# EAGLE design LaserModulev1.1 (EAGLE 7.5.0)
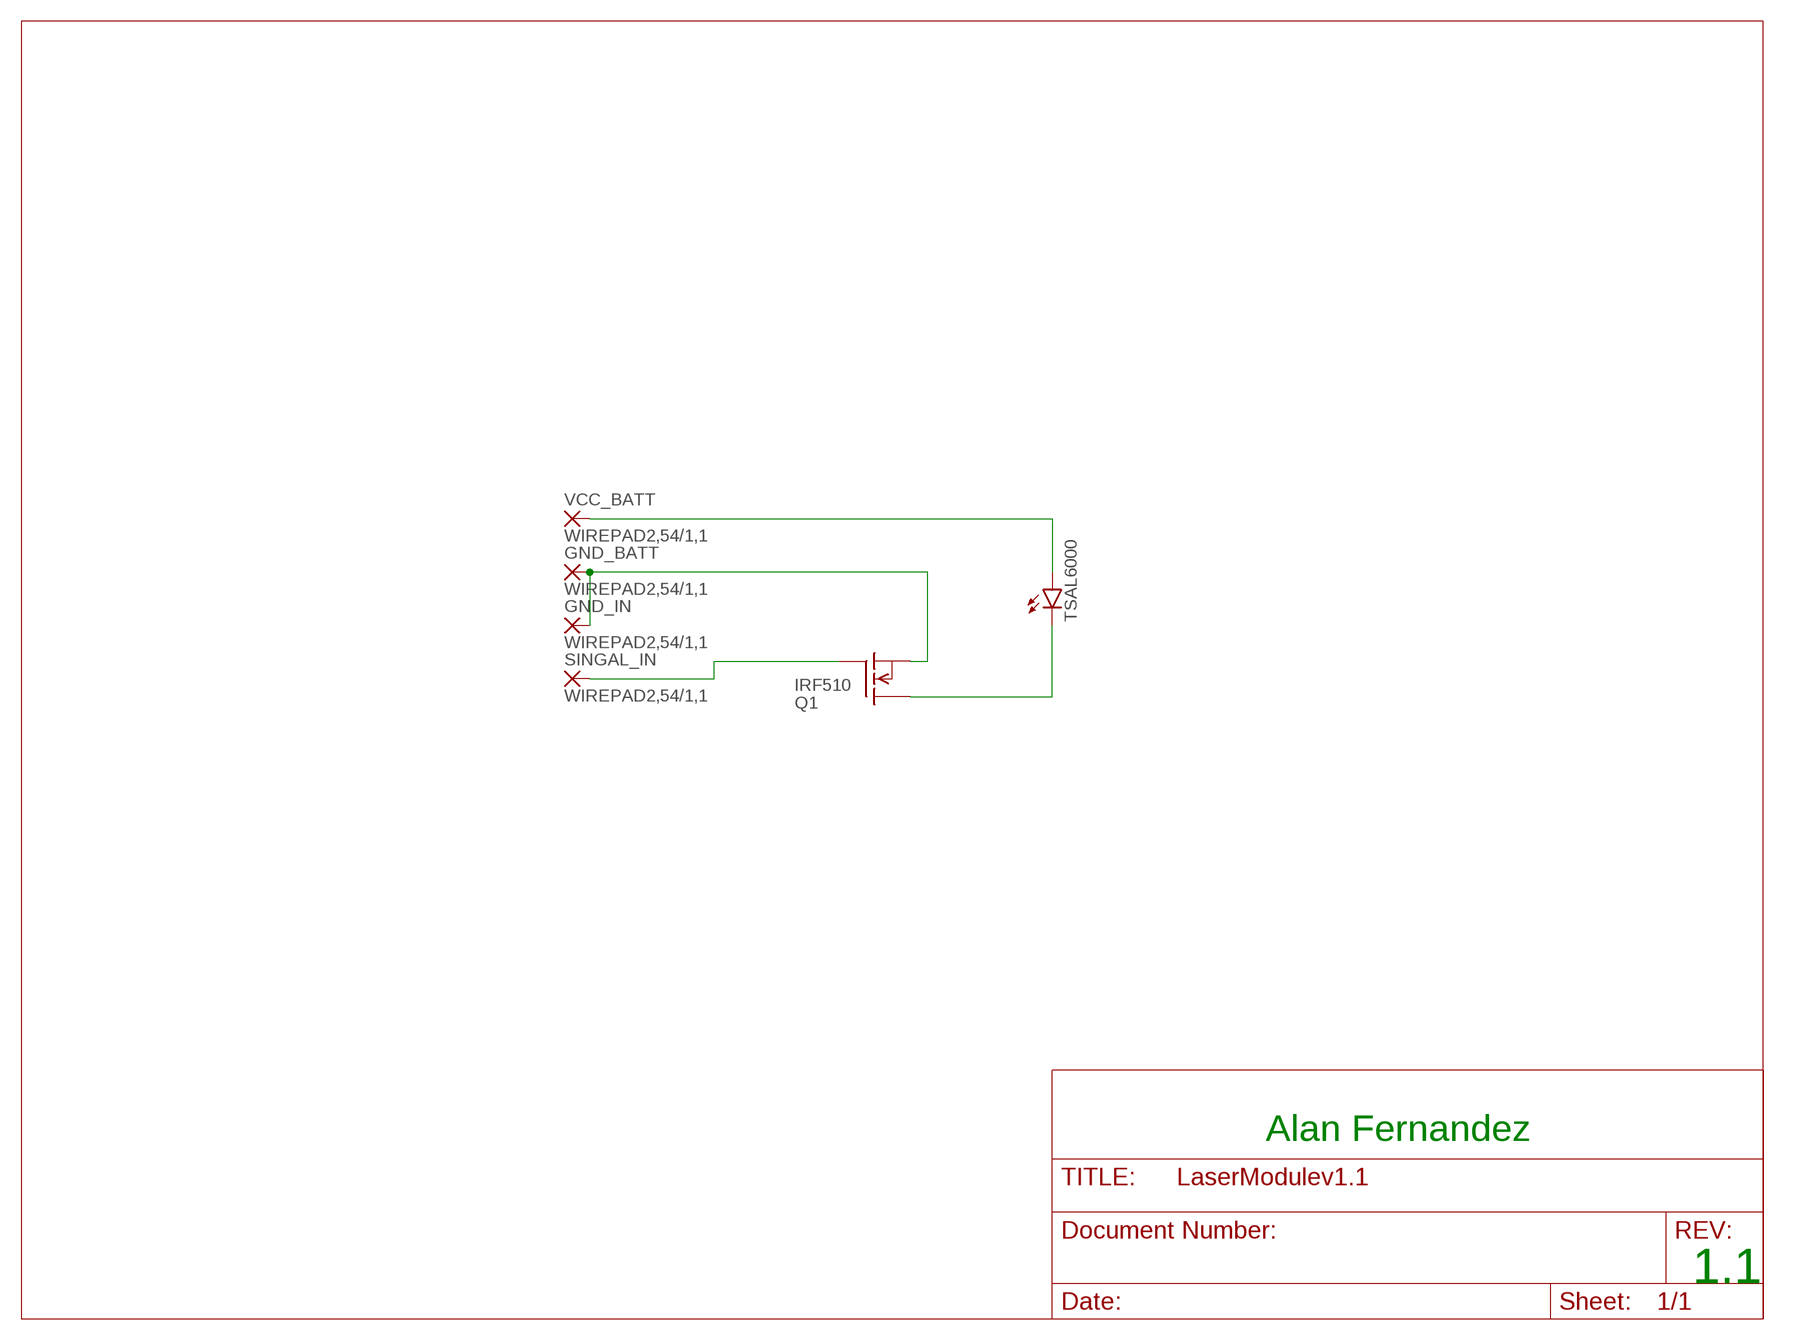
[diagram p0: schematic, sheet 1]

## Parts
GND_BATT  WIREPAD2,54/1,1  [2,54/1,1]
GND_IN  WIREPAD2,54/1,1  [2,54/1,1]
Q1  IRF510  [TO220]
SINGAL_IN  WIREPAD2,54/1,1  [2,54/1,1]
TSAL6000  LED5MM  [LED5MM]
VCC_BATT  WIREPAD2,54/1,1  [2,54/1,1]

## Nets
GND: GND_BATT.1(P) GND_IN.1(P) Q1.3(S)
N$1: Q1.1(G) SINGAL_IN.1(P)
N$3: TSAL6000.A VCC_BATT.1(P)
N$4: Q1.2(D) TSAL6000.K(C)

## Notes on the sheet
- Alan Fernandez
- 1.1

## Library data of the parts
GND_BATT GND_IN SINGAL_IN VCC_BATT = wirepad:WIREPAD: Wire PAD connect wire on PCB
Q1 = transistor-fet:IRF510: N-Channel Enhancement MOSFET (HEXFET); 100V; 5,6A; 0,54Ohm
TSAL6000 = SparkFun-LED:LED: LEDs Standard schematic elements and footprints for 5mm, 3mm, 1206, and 0603 sized LEDs. 5mm - Spark Fun Electronics SKU : COM-00529 (and others)

## Board
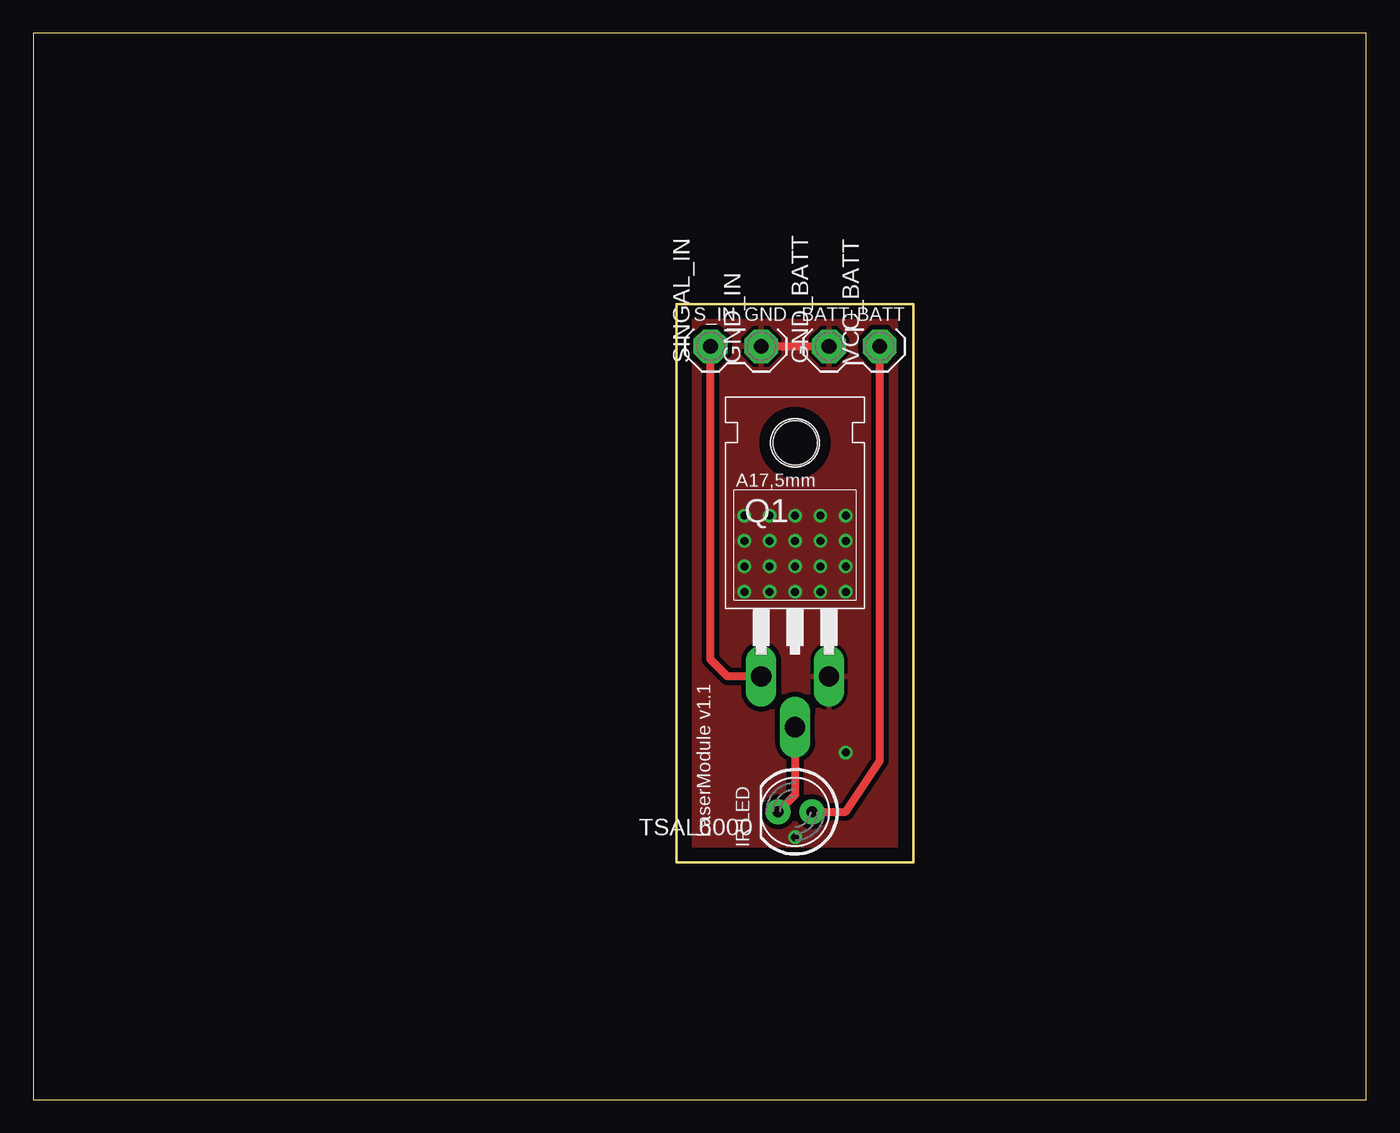
[diagram p1: board, top side]
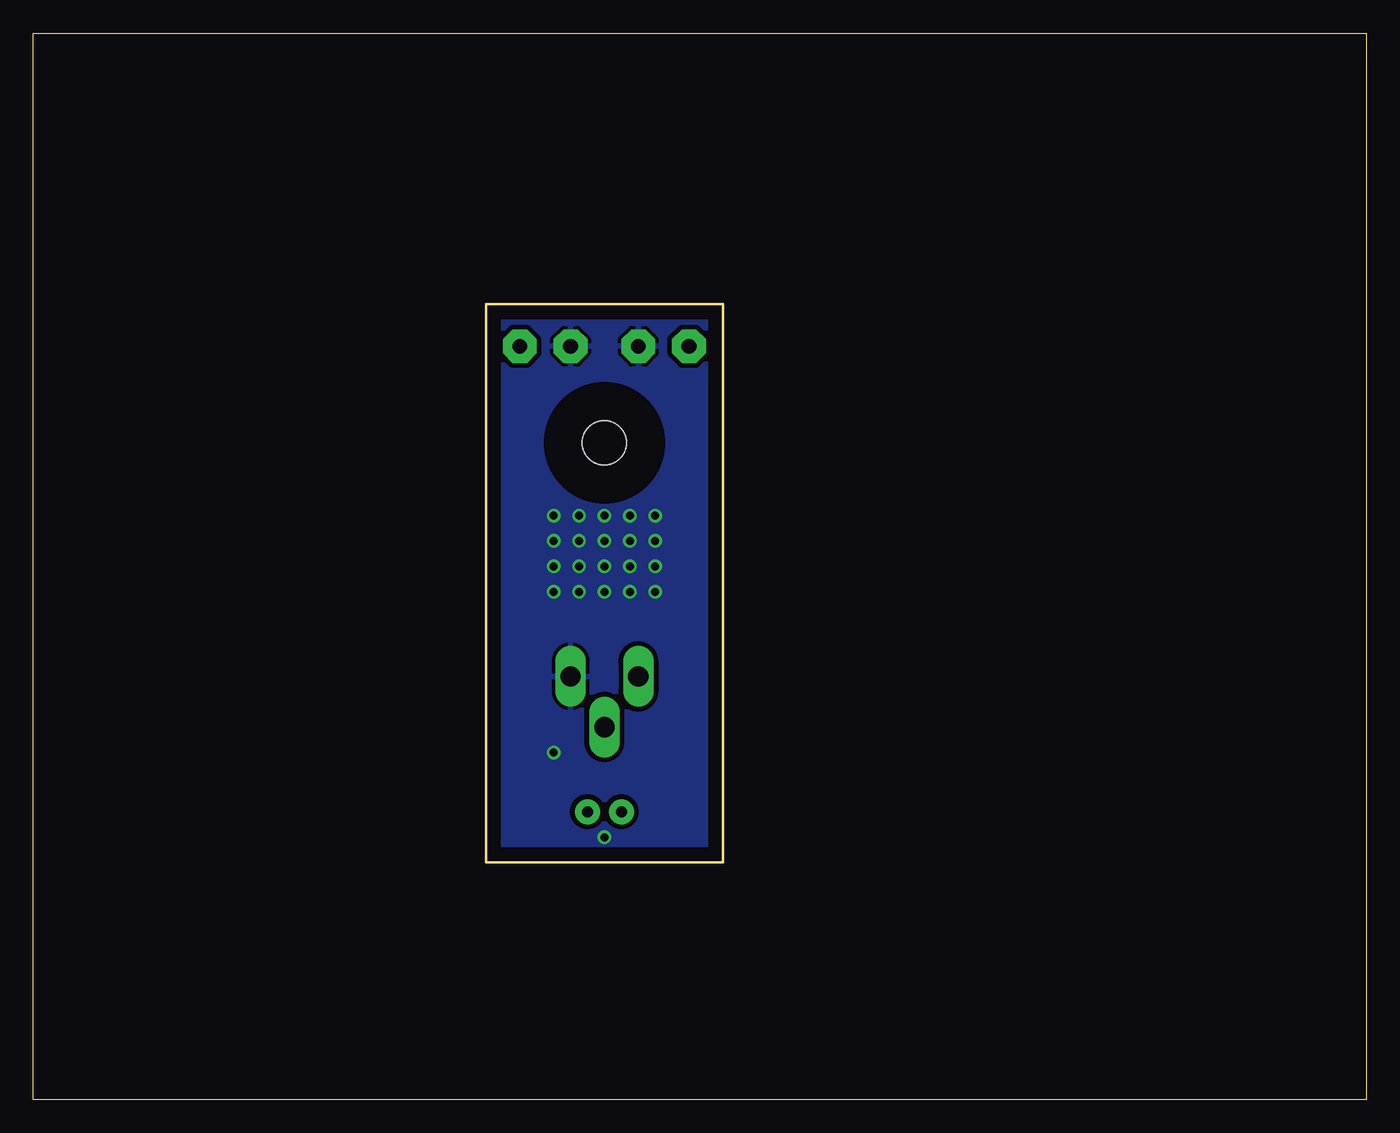
[diagram p2: board, bottom side, seen from below]

Size 100 x 80 mm. Coordinates in mm from the lower left corner, seen from the top.
Outline: 0,0 100,0 100,80 0,80 0,0
Outline: 48.26,59.69 48.26,17.78 66.04,17.78 66.04,59.69 48.26,59.69
Copper layers (1*16): Top 0.035mm / dielectric 1.5mm / Bottom 0.035mm
Design rules "default": minimum track width 10mil, minimum drill 24mil, track to track 8mil, track to pad 8mil, pad to pad 8mil, via to via 8mil, smd to smd 8mil, copper to edge 40mil, drill to drill 8mil, minimum pad ring 10mil, minimum via ring 8mil, stop-mask expansion 4mil, vias tented up to drill 0mil, thermal gap 10mil

### Footprints (pad centres in the part's own frame; a part is rotated, then mirrored left to right if it is on the bottom)
2,54/1,1 = drill 1.118 pad 2.54 octagon: 1 0,0
TO220 = drill 1.524 long: 1 -2.54,-6.35; 2 0,-10.16; 3 2.54,-6.35 | hole 3.302: 0,11.176
LED5MM = drill 0.813 pad 1.88: A -1.27,0; K 1.27,0

### Placement (x,y rotation side)
GND_BATT  59.69,56.52 90 top
GND_IN  54.61,56.52 90 top
Q1  57.15,38.1 0 top
SINGAL_IN  50.8,56.52 90 top
TSAL6000  57.15,21.59 180 top
VCC_BATT  63.5,56.52 90 top

### Tracks (layer width: path | path; a pad name or v marks a point on that pad's centre or on a via)
GND  (via drill 0.6)
  Top 0.61: GND_IN.1 GND_BATT.1
  other vias: 53.34,43.81 55.24,43.81 57.15,43.81 59.05,43.81 60.96,43.81 53.34,41.91 55.24,41.91 57.15,41.91 59.05,41.91 60.96,41.91 53.34,40.01 55.24,40.01 57.15,40.01 59.05,40.01 60.96,40.01 53.34,38.1 55.24,38.1 57.15,38.1 59.05,38.1 60.96,38.1 60.96,26.04 57.15,19.68
  pour Bottom (isolate 0.356): 48.26,59.69 48.26,17.78 66.04,17.78 66.04,59.69
  pour Top (isolate 0.356): 48.26,59.69 66.04,59.69 66.04,17.78 48.26,17.78
N$1
  Top 0.61: Q1.1 52.07,31.75 50.8,33.02 SINGAL_IN.1
N$3
  Top 0.61: TSAL6000.A 60.96,21.59 63.5,25.4 VCC_BATT.1
N$4
  Top 0.61: Q1.2 57.15,22.86 TSAL6000.K

### Text on the board
tPlace: S_IN | GND | -BATT | +BATT | IR LED | LaserModule v1.1